# Altium schematic sheet 按键电路.SchDoc
size A4
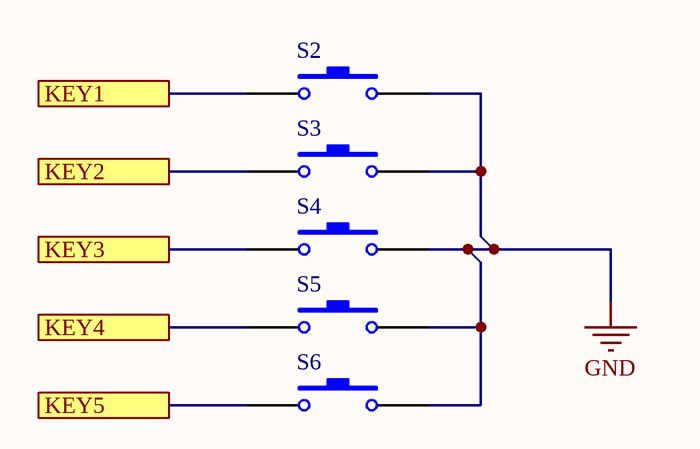
[diagram p0: 按键电路.SchDoc]

## Parts
S2  KEY  [SW-MINI]  (value not drawn)
S3  KEY  [SW-MINI]  (value not drawn)
S4  KEY  [SW-MINI]  (value not drawn)
S5  KEY  [SW-MINI]  (value not drawn)
S6  KEY  [SW-MINI]  (value not drawn)

## Ports
KEY1, KEY2, KEY3, KEY4, KEY5

## Nets
GND: S2.2 S3.2 S4.2 S5.2 S6.2
KEY1: S2.1 ; port KEY1
KEY2: S3.1 ; port KEY2
KEY3: S4.1 ; port KEY3
KEY4: S5.1 ; port KEY4
KEY5: S6.1 ; port KEY5

## Library data of the parts
S2-S6 = SW-PB: Switch; Published: 24-Mar-1999; LatestRevisionDate: 17-Jul-2002; LatestRevisionNote: Re-released for DXP Platform.; PackageReference: SPST-2; Publisher: Altium Limited; PackageDescription: Switch; 2 Leads